# EAGLE design SMALL deported Antenna (EAGLE 7.4.0)
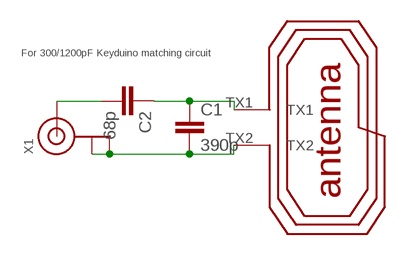
[diagram p0: schematic, sheet 1]

## Parts
C1  390p  C-EUC0603  [C0603]
C2  68p  C-EUC0603  [C0603]
U$1  ANT_V7  [ANT_13.56_P7]
X1  ANTENNA_U.FL  [U.FL]

## Nets
N$1: C2.2 X1.3(SIGNAL)
N$2: C1.2 U$1.TX2 X1.1(GND) X1.2(GND)
N$3: C1.1 C2.1 U$1.TX1
Unconnected: U$1.XX1 U$1.XX4

## Notes on the sheet
- For 300/1200pF Keyduino matching circuit

## Library data of the parts
C1 C2 = rcl:C-EU: CAPACITOR, European symbol
U$1 = Mrstein:ANT_V7
X1 = adafruit:ANTENNA_U.FL: U.FL Antenna Connector

## Net classes
1 Ground: width 0.61 mm, clearance 0.254 mm

## Board
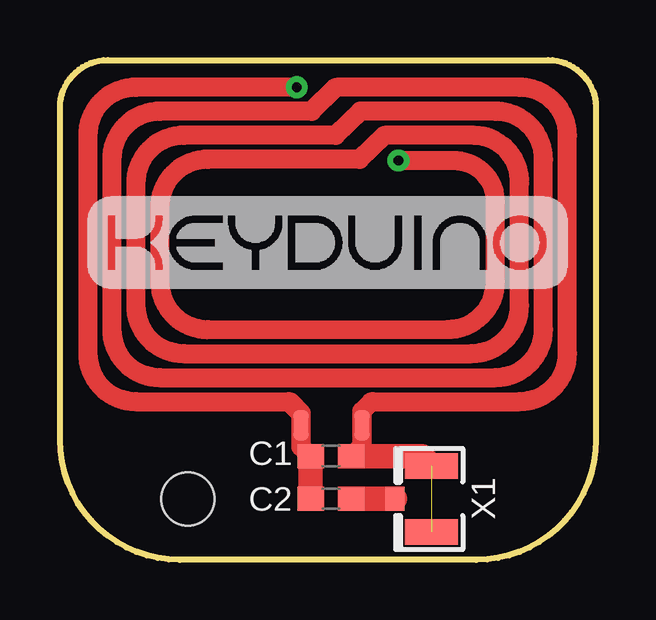
[diagram p1: board, top side]
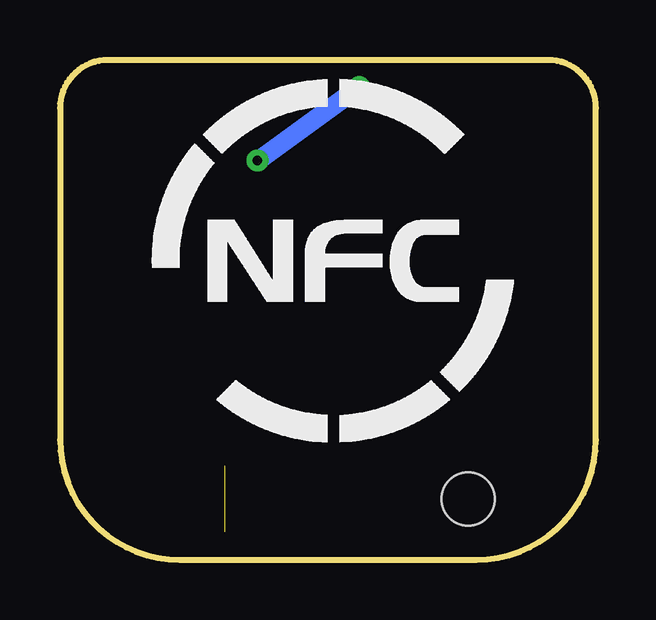
[diagram p2: board, bottom side, seen from below]

Size 22.35 x 20.83 mm. Coordinates in mm from the lower left corner, seen from the top.
Outline: 2,20.83 20.35,20.83 arc-90 22.35,18.83 22.35,5 arc-90 17.35,0 5,0 arc-90 0,5 0,18.83 arc-90 2,20.83
Copper layers (1*16): Top 0.035mm / dielectric 1.5mm / Bottom 0.035mm
Design rules "default": minimum track width 10mil, minimum drill 24mil, track to track 8mil, track to pad 8mil, pad to pad 8mil, via to via 8mil, smd to smd 8mil, copper to edge 40mil, drill to drill 8mil, minimum pad ring 10mil, minimum via ring 8mil, stop-mask expansion 4mil, vias tented up to drill 0mil, thermal gap 10mil
Holes 2.2 mm at 5.33,2.54

### Footprints (pad centres in the part's own frame; a part is rotated, then mirrored left to right if it is on the bottom)
C0603 = smd 1.1 x 1: 1 -0.85,0; 2 0.85,0
ANT_13.56_P7 = smd 0.635 x 1.27: TX1 -0.361,-7.597; TX2 2.179,-7.597 | drill 0.4 pad 0.813: XX1 3.701,3.436; XX4 -0.541,6.484
U.FL = smd 2.2 x 1.05: 1 0,1.375; 2 0,-1.375 | smd 0.8 x 1: 3 1.525,0

### Placement (x,y rotation side)
C1  11.3,4.32 0 top
C2  11.3,2.54 0 top
U$1  10.41,13.21 0 top
X1  15.49,2.54 180 top

### Tracks (layer width: path | path; a pad name or v marks a point on that pad's centre or on a via)
N$1
  Top 1.016: C2.2 X1.3
N$2  (1 unrouted)
  Top 0.813: C1.2 12.59,4.76 U$1.TX2
  Top 1.016: X1.2 15.09,4.32 C1.2
N$3
  Top 0.813: C1.1 10.05,4.72 U$1.TX1
  Top 1.016: C2.1 C1.1